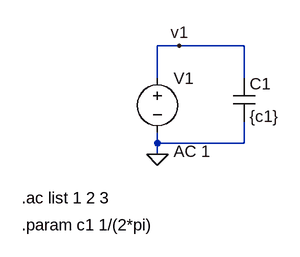
[diagram p0: schematic vsource ac.asc]
vsource ac.asc, the LTspice schematic file:
Version 4
SHEET 1 880 680
WIRE 144 96 112 96
WIRE 240 96 144 96
WIRE 112 144 112 96
WIRE 240 144 240 96
WIRE 112 240 112 224
WIRE 240 240 240 208
WIRE 240 240 112 240
WIRE 112 256 112 240
FLAG 112 256 0
FLAG 144 96 v1
SYMBOL voltage 112 128 R0
WINDOW 123 24 124 Left 2
WINDOW 39 0 0 Left 0
SYMATTR Value2 AC 1
SYMATTR InstName V1
SYMATTR Value ""
SYMBOL cap 224 144 R0
SYMATTR InstName C1
SYMATTR Value {c1}
TEXT -88 320 Left 2 !.ac list 1 2 3
TEXT -88 360 Left 2 !.param c1 1/(2*pi)

The netlist it stands for:
* vsource ac.asc
V1 v1 0 AC 1
C1 v1 0 {c1}
.ac list 1 2 3
.param c1 1/(2*pi)
.backanno
.end